# EAGLE design packmonitor (EAGLE 7.3.0)
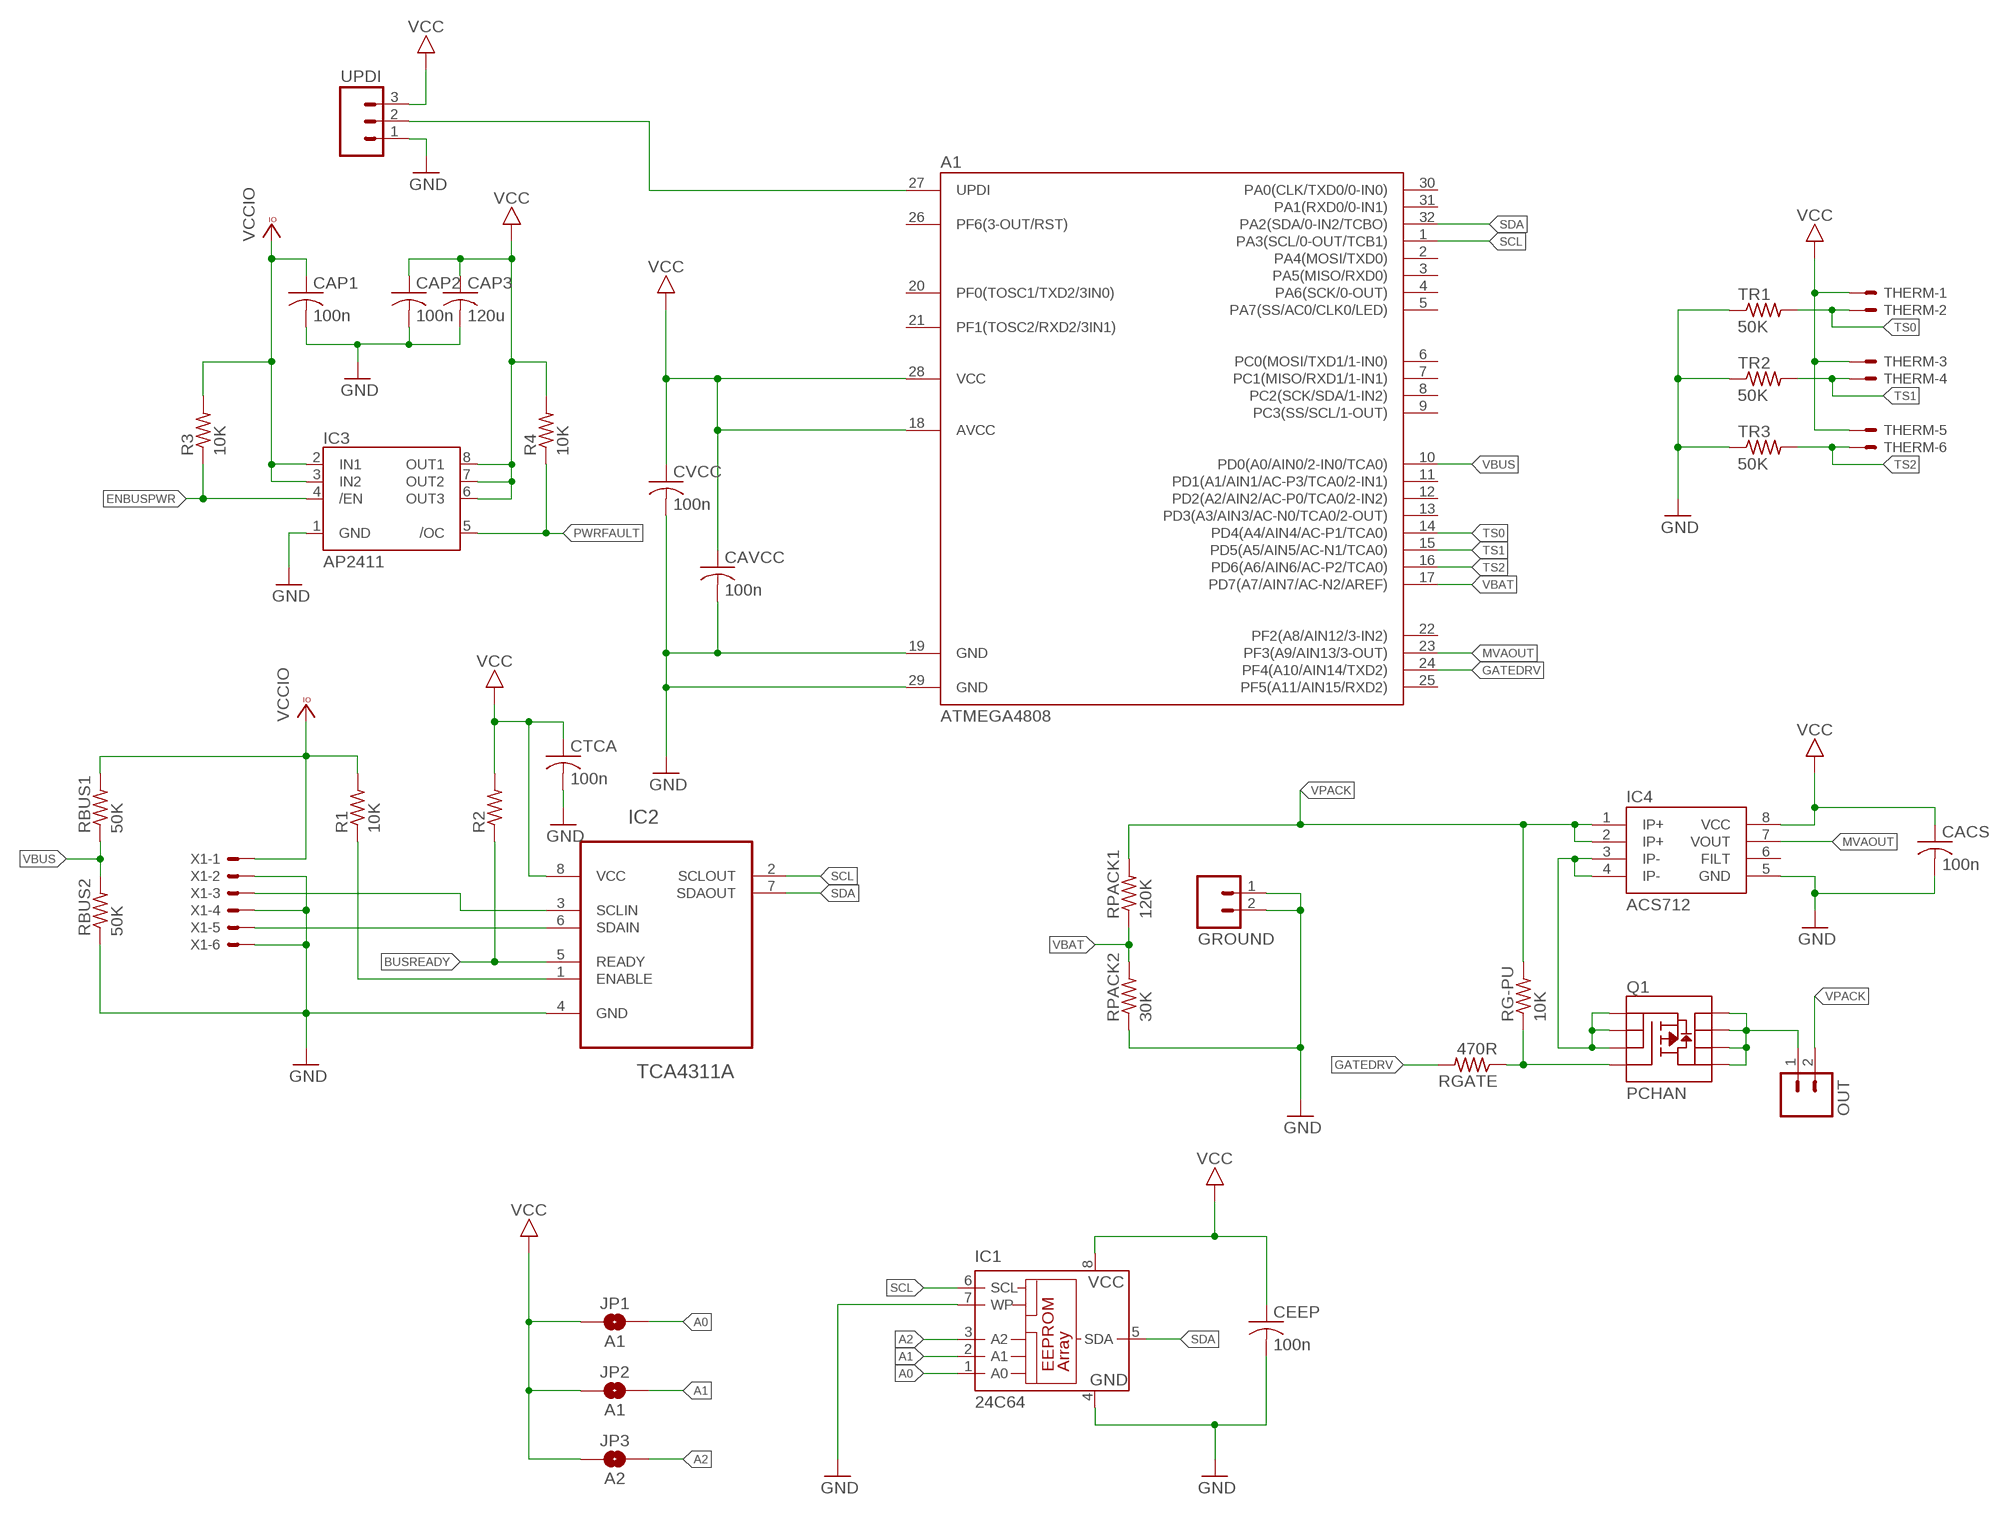
[diagram p0: schematic, sheet 1]

## Parts
A1  ATMEGA4808  ATMEGA4808-TQFN32A  [TQFP32-08]
CACS  100n  C-USC0603  [C0603]
CAP1  100n  C-USC0603  [C0603]
CAP2  100n  C-USC0603  [C0603]
CAP3  120u  C-USC1206  [C1206]
CAVCC  100n  C-USC0603  [C0603]
CEEP  100n  C-USC0603  [C0603]
CTCA  100n  C-USC0603  [C0603]
CVCC  100n  C-USC0603  [C0603]
GROUND  M023.5MM  [SCREWTERMINAL-3.5MM-2]
IC1  24C64  24C04CSN  [SO-08]
IC2  TCA4311A  PCA9511AD,118  [SOIC127P600X175-8N]
IC3  AP2411  TPS2041BD  [SO08]
IC4  ACS712  [SO08]
JP1  A1  JUMPER-SMT_2_NO_SILK  [SMT-JUMPER_2_NO_SILK]
JP2  A1  JUMPER-SMT_2_NO_SILK  [SMT-JUMPER_2_NO_SILK]
JP3  A2  JUMPER-SMT_2_NO_SILK  [SMT-JUMPER_2_NO_SILK]
OUT  M023.5MM  [SCREWTERMINAL-3.5MM-2]
Q1  PCHAN  MOSFET-PCHANNEL-SOIC8SOIC8  [SO08]
R1  10K  R-US_R0603  [R0603]
R2  R-US_R0603  [R0603]
R3  10K  R-US_R0603  [R0603]
R4  10K  R-US_R0603  [R0603]
RBUS1  50K  R-US_R0805  [R0805]
RBUS2  50K  R-US_R0805  [R0805]
RG-PU  10K  R-US_R0603  [R0603]
RGATE  470R  R-US_R0603  [R0603]
RPACK1  120K  R-US_R0805  [R0805]
RPACK2  30K  R-US_R0805  [R0805]
THERM  JST-XH-06-PIN-ROUND-PAD  [JST-XH-06-PACKAGE-ROUND-PAD]
TR1  50K  R-US_R0805  [R0805]
TR2  50K  R-US_R0805  [R0805]
TR3  50K  R-US_R0805  [R0805]
UPDI  M03PTH  [1X03]
X1  JST-XH-06-PIN-LONG-PAD  [JST-XH-06-PACKAGE-LONG-PAD]

## Nets
A0: IC1.1(A0) JP1.2
A1: IC1.2(A1) JP2.2
A2: IC1.3(A2) JP3.2
BUSREADY: IC2.5(READY) R2.1
ENBUSPWR: IC3.4(/EN) R3.1
GATE: Q1.4(G) RG-PU.1 RGATE.1
GATEDRV: A1.24(PF4(A10/AIN14/TXD2)) RGATE.2
GND: A1.19(GND) A1.29(GND) CACS.2 CAP1.2 CAP2.2 CAP3.2 CAVCC.2 CEEP.2 CTCA.2 CVCC.2 GROUND.1 GROUND.2 IC1.4(GND) IC1.7(WP) IC2.4(GND) IC3.1(GND) IC4.5(GND) RBUS2.1 RPACK2.1 TR1.1 TR2.1 TR3.1 UPDI.1 X1.2 X1.4 X1.6
MVAOUT: A1.23(PF3(A9/AIN13/3-OUT)) IC4.7(VOUT)
N$3: IC2.6(SDAIN) X1.5
N$4: IC2.3(SCLIN) X1.3
N$6: IC2.1(ENABLE) R1.1
P+IN: IC4.3(IP-) IC4.4(IP-) Q1.1(S) Q1.2(S) Q1.3(S)
P+OUT: OUT.1 Q1.5(D) Q1.6(D) Q1.7(D) Q1.8(D)
PWRFAULT: IC3.5(/OC) R4.1
SCL: A1.1(PA3(SCL/0-OUT/TCB1)) IC1.6(SCL) IC2.2(SCLOUT)
SDA: A1.32(PA2(SDA/0-IN2/TCBO)) IC1.5(SDA) IC2.7(SDAOUT)
TS0: A1.14(PD4(A4/AIN4/AC-P1/TCA0)) THERM.2 TR1.2
TS1: A1.15(PD5(A5/AIN5/AC-N1/TCA0)) THERM.4 TR2.2
TS2: A1.16(PD6(A6/AIN6/AC-P2/TCA0)) THERM.6 TR3.2
UPDI: A1.27(UPDI) UPDI.2
VBAT: A1.17(PD7(A7/AIN7/AC-N2/AREF)) RPACK1.1 RPACK2.2
VBUS: A1.10(PD0(A0/AIN0/2-IN0/TCA0)) RBUS1.1 RBUS2.2
VCC: A1.18(AVCC) A1.28(VCC) CACS.1 CAP2.1 CAP3.1 CAVCC.1 CEEP.1 CTCA.1 CVCC.1 IC1.8(VCC) IC2.8(VCC) IC3.6(OUT3) IC3.7(OUT2) IC3.8(OUT1) IC4.8(VCC) JP1.1 JP2.1 JP3.1 R2.2 R4.2 THERM.1 THERM.3 THERM.5 UPDI.3
VCCIO: CAP1.1 IC3.2(IN1) IC3.3(IN2) R1.2 R3.2 RBUS1.2 X1.1
VPACK: IC4.1(IP+) IC4.2(IP+) OUT.2 RG-PU.2 RPACK1.2
Unconnected: A1.2(PA4(MOSI/TXD0)) A1.3(PA5(MISO/RXD0)) A1.4(PA6(SCK/0-OUT)) A1.5(PA7(SS/AC0/CLK0/LED)) A1.6(PC0(MOSI/TXD1/1-IN0)) A1.7(PC1(MISO/RXD1/1-IN1)) A1.8(PC2(SCK/SDA/1-IN2)) A1.9(PC3(SS/SCL/1-OUT)) A1.11(PD1(A1/AIN1/AC-P3/TCA0/2-IN1)) A1.12(PD2(A2/AIN2/AC-P0/TCA0/2-IN2)) A1.13(PD3(A3/AIN3/AC-N0/TCA0/2-OUT)) A1.20(PF0(TOSC1/TXD2/3IN0)) A1.21(PF1(TOSC2/RXD2/3IN1)) A1.22(PF2(A8/AIN12/3-IN2)) A1.25(PF5(A11/AIN15/RXD2)) A1.26(PF6(3-OUT/RST)) A1.30(PA0(CLK/TXD0/0-IN0)) A1.31(PA1(RXD0/0-IN1)) IC4.6(FILT)

## Library data of the parts
A1 = microchip-special:ATMEGA4808-TQFN32
CACS CAP1-CAP3 CAVCC CEEP CTCA CVCC = rcl:C-US: CAPACITOR, American symbol
GROUND OUT = SparkFun-Connectors:M02: Standard 2-pin 0.1" header. Use with - straight break away headers ( PRT-00116) - right angle break away headers (PRT-00553) - swiss pins (PRT-00743) - machine pins (PRT-00117) - female headers (PRT-00115) Molex polarized connector foot print use with: PRT-08233 with associated crimp pins and housings. 2.54_SCREWTERM for use with PRT-10571. 3.5mm Screw Terminal footprints for PRT-08084 5mm Screw Terminal footprints for use with PRT-08432; PROD_ID: CONN-08399
IC1 = microchip:24C*: Serial EEPROM 1 K/2 K/4 K; OC_FARNELL: unknown; OC_NEWARK: unknown
IC2 = NXP_By_element14_Batch_1:PCA9511AD,118: Hot swappable I2C-bus and SMBus bus buffer; MPN: PCA9511AD,118; OC_FARNELL: -; OC_NEWARK: 70R6468; PACKAGE: SOIC-8; SUPPLIER: NXP
IC3 = ti-special:TPS2041B: The TPS204xB/TPS205xB power-distribution switches are intended for applications where heavy capacitive loads and short circuits are likely to be encountered. These devices incorporates 70-m? N-channel MOSFET power switches for power-distribution systems that require multiple power switches in a single package. Each switch is controlled by a logic enable input. Gate drive is provided by an internal charge pump designed to control the power-switch rise times and fall times to minimize current surges during switching. The charge pump requires no external components and allows operation from supplies as low as 2.7 V.
IC4 = SparkFun-AnalogIC:ACS712: Hall-effect-based isolated linear current sensor; PROD_ID: IC-08964
JP1-JP3 = SparkFun-Jumpers:JUMPER-SMT_2_NO: Normally open jumper This jumper has two pads in close proximity to each other. Apply solder to close the connection. Round pads are easier to solder for beginners, but are a lot larger. SparkFun Product that uses the round pads: SparkFun EL Sequencer <https://www.sparkfun.com/products/12781>
Q1 = SparkFun-DiscreteSemi:MOSFET-PCHANNEL-SOIC8: Generic 8-pin PMOSFET
R1-R4 RBUS1 RBUS2 RG-PU RGATE RPACK1 RPACK2 TR1-TR3 = rcl:R-US_: RESISTOR, American symbol
THERM X1 = Rembrandt Electronics - JST XH Connectors v1-0:JST-XH-06-PIN: JST XH Connector 2 Pin Wire to board connector. Pitch: 2,54 mm, (0.100") Number of pins: 6 Created by Rembrandt Electronics www.rembrandtelectronics.com
UPDI = SparkFun-Connectors:M03: Header 3 Standard 3-pin 0.1" header. Use with straight break away headers (SKU : PRT-00116), right angle break away headers (PRT-00553), swiss pins (PRT-00743), machine pins (PRT-00117), and female headers (PRT-00115). Molex polarized connector foot print use with SKU : PRT-08232 with associated crimp pins and housings.

## Board
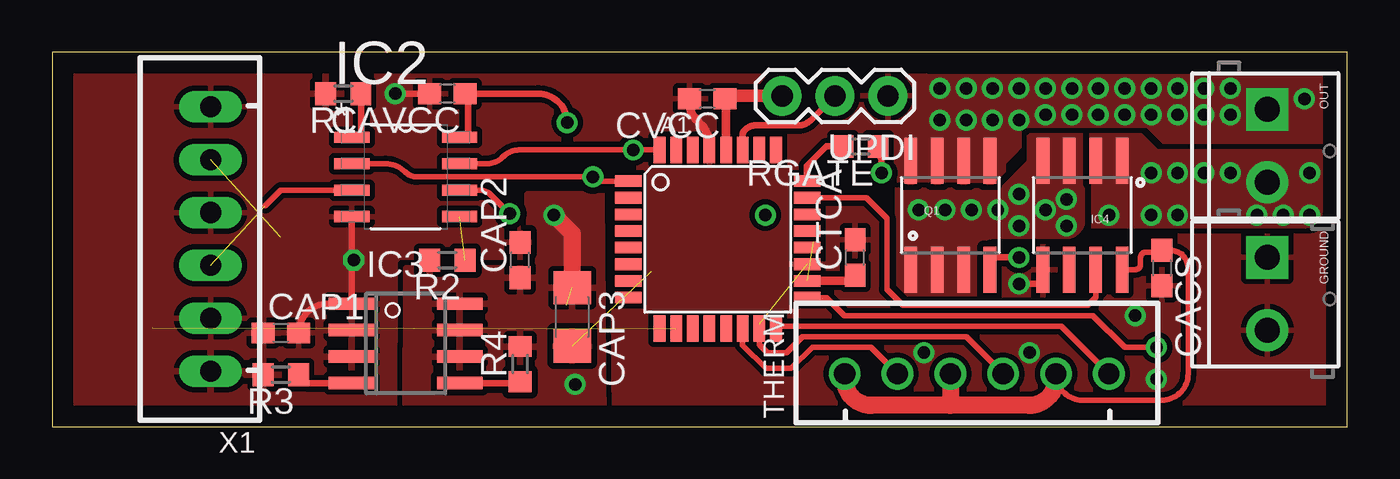
[diagram p1: board, top side]
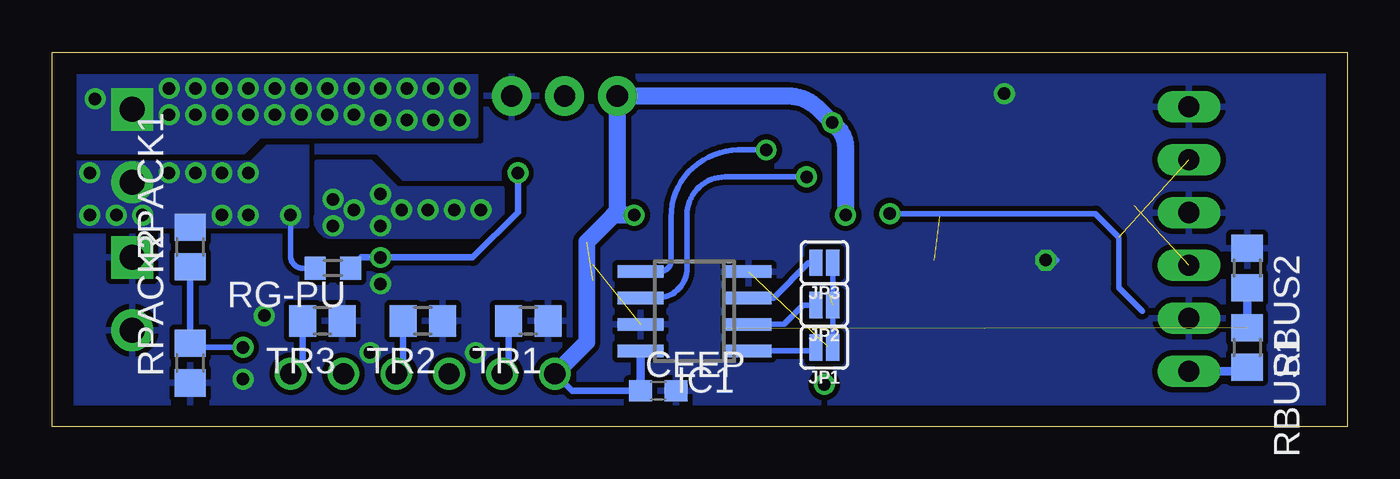
[diagram p2: board, bottom side, seen from below]

Size 62.27 x 18 mm. Coordinates in mm from the lower left corner, seen from the top.
Outline: 0,0 62.27,0 62.27,18 0,18 0,0
Copper layers (1*16): Top 0.035mm / dielectric 1.5mm / Bottom 0.035mm
Design rules "default": minimum track width 10mil, minimum drill 24mil, track to track 8mil, track to pad 8mil, pad to pad 8mil, via to via 8mil, smd to smd 8mil, copper to edge 40mil, drill to drill 8mil, minimum pad ring 10mil, minimum via ring 8mil, stop-mask expansion 4mil, vias tented up to drill 0mil, thermal gap 10mil

### Footprints (pad centres in the part's own frame; a part is rotated, then mirrored left to right if it is on the bottom)
TQFP32-08 = smd 1.27 x 0.559: 1 -4.293,2.8; 2 -4.293,2; 3 -4.293,1.2; 4 -4.293,0.4; 5 -4.293,-0.4; 6 -4.293,-1.2; 7 -4.293,-2; 8 -4.293,-2.8; 17 4.293,-2.8; 18 4.293,-2; 19 4.293,-1.2; 20 4.293,-0.4; 21 4.293,0.4; 22 4.293,1.2; 23 4.293,2; 24 4.293,2.8 | smd 0.559 x 1.27: 9 -2.8,-4.293; 10 -2,-4.293; 11 -1.2,-4.293; 12 -0.4,-4.293; 13 0.4,-4.293; 14 1.2,-4.293; 15 2,-4.293; 16 2.8,-4.293; 25 2.8,4.293; 26 2,4.293; 27 1.2,4.293; 28 0.4,4.293; 29 -0.4,4.293; 30 -1.2,4.293; 31 -2,4.293; 32 -2.8,4.293
C0603 = smd 1.1 x 1: 1 -0.85,0; 2 0.85,0
C1206 = smd 1.6 x 1.8: 1 -1.4,0; 2 1.4,0
SCREWTERMINAL-3.5MM-2 = drill 1.2 pad 2.032 square: 1 0,0 | drill 1.2 pad 2.032: 2 3.5,0
SO-08 = smd 0.6 x 2.2: 1 -1.905,-2.6; 2 -0.635,-2.6; 3 0.635,-2.6; 4 1.905,-2.6; 5 1.905,2.6; 6 0.635,2.6; 7 -0.635,2.6; 8 -1.905,2.6
SOIC127P600X175-8N = smd 1.702 x 0.533: 1 -2.591,1.905; 2 -2.591,0.635; 3 -2.591,-0.635; 4 -2.591,-1.905; 5 2.591,-1.905; 6 2.591,-0.635; 7 2.591,0.635; 8 2.591,1.905
SO08 = smd 0.6 x 2.2: 1 -1.905,-2.6; 2 -0.635,-2.6; 3 0.635,-2.6; 4 1.905,-2.6; 5 1.905,2.6; 6 0.635,2.6; 7 -0.635,2.6; 8 -1.905,2.6
SO08' = smd 0.61 x 2.21: 1 -1.905,-2.616; 2 -0.635,-2.616; 3 0.635,-2.616; 4 1.905,-2.616; 5 1.905,2.616; 6 0.635,2.616; 7 -0.635,2.616; 8 -1.905,2.616
SMT-JUMPER_2_NO_SILK = smd 0.635 x 1.27: 1 -0.406,0; 2 0.406,0
R0603 = smd 1 x 1.1: 1 -0.85,0; 2 0.85,0
R0805 = smd 1.3 x 1.5: 1 -0.95,0; 2 0.95,0
JST-XH-06-PACKAGE-ROUND-PAD = drill 1.016: 1 -6.35,0; 2 -3.81,0; 3 -1.27,0; 4 1.27,0; 5 3.81,0; 6 6.35,0
1X03 = drill 1.016 pad 1.88: 1 0,0; 2 2.54,0; 3 5.08,0
JST-XH-06-PACKAGE-LONG-PAD = drill 1.016 long: 1 -6.35,0; 2 -3.81,0; 3 -1.27,0; 4 1.27,0; 5 3.81,0; 6 6.35,0

### Placement (x,y rotation side)
A1  32,9 0 top
CACS  53.34,7.62 270 top
CAP1  11,4.5 0 top
CAP2  22.5,8 90 top
CAP3  25,5.27 270 top
CAVCC  19,16 180 top
CEEP  33.13,1.72 0 bottom
CTCA  38.61,8.12 90 top
CVCC  31.5,15.75 180 top
GROUND  58.42,8.13 270 top
IC1  31.39,5.55 90 bottom
IC2  17,12 0 top
IC3  17,4 270 top
IC4  ACS712  [SO08']  49.53,10.16 180 top
JP1  25.15,3.81 180 bottom
JP2  25.15,5.84 180 bottom
JP3  25.15,7.87 180 bottom
OUT  58.42,15.24 270 top
Q1  PCHAN  [SO08']  43.18,10.16 0 top
R1  14,16 180 top
R2  19,8 180 top
R3  11,2.5 180 top
R4  22.5,3 90 top
RBUS1  4.83,3.81 270 bottom
RBUS2  4.83,7.62 270 bottom
RG-PU  48.77,7.62 180 bottom
RGATE  38.86,13.46 180 top
RPACK1  55.63,8.64 90 bottom
RPACK2  55.63,3.05 90 bottom
THERM  44.45,2.54 0 top
TR1  39.37,5.08 180 bottom
TR2  44.45,5.08 180 bottom
TR3  49.28,5.08 180 bottom
UPDI  40.18,15.89 180 top
X1  7.62,9.02 90 top

### Tracks (layer width: path | path; a pad name or v marks a point on that pad's centre or on a via)
A0
  Bottom 0.254: IC1.1 25.55,3.64 JP1.2
A1
  Bottom 0.254: JP2.2 26.16,5.84 27.09,4.91 IC1.2
A2
  Bottom 0.254: IC1.3 27.6,6.18 25.91,7.87 JP3.2
BUSREADY  (1 unrouted)
ENBUSPWR
  Top 0.305: R3.1 arc90 12.26,2.1 IC3.4
GATE  (via drill 0.6)
  Top 0.305: 39.88,12.95 v39.88,12.19 | Q1.4 45.09,8.13 v46.48,8.13
  Top 0.406: RGATE.1 39.88,12.95
  Bottom 0.305: v39.88,12.19 39.88,10.3 42.05,8.13 v46.48,8.13 47.41,8.13 RG-PU.1
GATEDRV
  Top 0.305: RGATE.2 37.23,13.46 36.29,12.53 A1.24
GND  (via drill 0.6)  (2 unrouted)
  Top 0.305: CAP1.2 arc-90 13.26,5.91 IC3.1 14.4,8 v14.5,8 14.41,8 IC2.4 | CAVCC.2 v16.5,16 | v46.48,6.86 47.7,6.86 IC4.5
  Top 0.406: CVCC.2 30.65,15.54 arc45 30.97,14.75 31.18,14.54 arc-45 31.6,13.53 A1.29
  Bottom 0.305: v14.5,8 14,8
  other vias: 52.07,5.33 53.09,2.29 41.91,3.56 46.99,3.56
  pour Bottom (isolate 0.254, rank 5): 0,18 62.27,18 62.27,0 0,0
  pour Top (isolate 0.254, rank 5): 62.23,18.03 0,18.03 0,0 62.23,0
MVAOUT
  Top 0.254: A1.23 39.15,11 40.13,10.02 40.13,6.6 40.89,5.84 49.78,5.84 50.16,6.22 IC4.7
N$3  (via drill 0.6)  (1 unrouted)
  Top 0.254: IC2.6 20.56,11.37 arc-45 21.08,11.15 v22,10.23
  Bottom 0.254: 9.86,5.54 11,6.68 11,9.11 12.12,10.23 v22,10.23
N$4  (1 unrouted)
  Top 0.254: 10.26,10.62 11,11.37 IC2.3
N$6
  Top 0.305: R1.1 14.85,13.9 IC2.1
P+IN  (via drill 0.6)
  other vias: 46.48,11.18 46.48,9.65 45.47,10.41 42.93,10.41 41.66,10.41 48.77,9.65 44.2,10.41 47.75,10.41 48.77,10.92
  pour Top (isolate 0.305, rank 3, no thermals): 49.53,13.97 49.53,9.95 arc-90 48.73,9.14 45.25,9.14 arc90 44.45,8.34 44.45,6.35 41.15,6.35 arc-90 40.64,6.86 40.64,11.43 45.72,11.43 46.99,12.7 46.99,13.97
  pour Bottom (isolate 0.254, rank 4, no thermals): 49.53,12.7 49.53,10.22 arc-90 48.96,9.14 40.64,9.14 40.64,11.43 45.72,11.43 46.99,12.7
P+OUT  (via drill 0.6)
  other vias: 42.67,16.26 42.67,14.73 43.94,14.73 43.94,16.26 45.21,16.26 45.21,14.73 46.48,16.26 46.48,14.73 51.56,16.26 51.56,14.99 52.83,14.99 52.83,16.26 54.1,16.26 54.1,14.99 55.37,14.99 55.37,16.26 56.64,16.26 60.2,15.75 56.64,14.99 50.29,16.26 49.02,16.26 47.75,16.26 47.75,14.99 49.02,14.99 50.29,14.99
  pour Top (isolate 0.254, rank 5, no thermals): 45.72,11.43 40.64,11.43 40.64,13.97 41.91,15.24 41.91,17.02 60.96,17.02 60.96,13.21 53.09,13.21 52.32,13.97 46.99,13.97 45.72,12.7
  pour Bottom (isolate 0.254, rank 3, no thermals): 41.91,13.97 41.91,17.02 60.96,17.02 60.96,13.21 53.09,13.21 52.32,13.97
PWRFAULT
  Top 0.305: IC3.5 22.45,2.1 arc90 R4.1
SCL  (via drill 0.6)
  Top 0.254: A1.1 26.2,11.8 v26,12 17.54,12 arc-45 16.97,12.24 16.97,12.24 arc45 16.02,12.63 IC2.2
  Bottom 0.254: IC1.6 33.19,6.18 arc-90 31.75,7.62 31.75,10.16 arc90 29.91,12 v26,12
SDA  (via drill 0.6)
  Top 0.254: IC2.7 20.92,12.63 arc45 21.64,12.94 21.68,12.97 arc-45 22.45,13.29 v27.94,13.29 A1.32
  Bottom 0.254: IC1.5 33.05,7.45 arc-90 32.51,7.99 32.51,10.07 arc90 29.29,13.29 v27.94,13.29
TS0
  Top 0.254: A1.14 33.2,3.91 34.32,2.79 35.53,2.79 36.55,3.81 39.37,3.81 THERM.2
  Bottom 0.305: THERM.2 40.32,2.86 TR1.2
TS1
  Top 0.254: A1.15 34,3.94 34.39,3.56 35.31,3.56 36.07,4.32 43.94,4.32 THERM.4
  Bottom 0.305: THERM.4 45.4,2.86 TR2.2
TS2
  Top 0.254: A1.16 34.8,4.83 48.51,4.83 THERM.6
  Bottom 0.305: THERM.6 50.23,3.11 TR3.2
UPDI
  Top 0.305: A1.27 33.2,14.04 arc-45 33.27,14.22 33.32,14.27 arc-45 33.83,14.48 35.88,14.48 arc45 36.47,14.72 UPDI.2
VBAT  (via drill 0.6)
  Top 0.254: A1.17 37.23,6.2 38.1,5.33 50.04,5.33 51.56,3.81 v53.09,3.81
  Bottom 0.254: v53.09,3.81 55.63,3.81 RPACK2.2
  Bottom 0.305: RPACK1.1 RPACK2.2
VBUS  (1 unrouted)
  Bottom 0.406: RBUS1.1 RBUS2.2
VCC  (via drill 0.6)  (2 unrouted)
  Top 0.254: THERM.5 arc90 49.53,1.27 53.34,1.27 arc90 54.61,2.54 54.61,7.62 arc90 53.76,8.47 CACS.1 53.34,8.38 52.58,8.38 arc90 52.32,8.13 52.32,7.81 arc-90 52.06,7.54 IC4.8
  Top 0.305: CAVCC.1 20,16 | IC2.8 19.59,14 20,14 20,15.85 CAVCC.1 | CAVCC.1 23.37,16 arc-90 v24.77,14.61 | IC4.8 51.44,6.76
  Top 0.406: 32.35,13.29 A1.28 32.4,15.69 CVCC.1 | CTCA.1 38.59,7 A1.18
  Top 0.61: CVCC.1 32.49,15.89 UPDI.3
  Top 0.813: v24.13,10.16 25,9.29 CAP3.1 | THERM.5 48.26,2.31 arc-90 46.97,1.02 43.18,1.02 | 43.18,1.02 39.4,1.02 arc-90 38.1,2.31 THERM.1 | THERM.3 43.18,1.02
  Bottom 0.254: JP1.1 JP2.1 JP3.1
  Bottom 0.305: CEEP.1 37.28,1.72 THERM.1
  Bottom 0.406: CEEP.1 IC1.8
  Bottom 0.813: v24.13,10.16 24.13,13.44 arc-45 24.5,14.34 v24.77,14.61 25.46,15.3 arc-45 26.89,15.89 UPDI.3 35.1,10.2 v34.29,10.16 35.28,10.16 36.58,8.87 36.58,4.06 THERM.1
  other vias: 25.15,2.03
  pour Top (isolate 0.305, rank 4): 17.02,7.62 17,0 26.5,0 26.42,11.18 22.86,11.18 22.86,7.62
VCCIO
  Bottom 0.406: RBUS1.2 5.12,2.67 X1.1
  pour Top (isolate 0.305, rank 5): 6,18 13.95,18 13.97,8.89 17,8.89 17,0 6,0
VPACK  (via drill 0.6)
  Bottom 0.254: RG-PU.2 50.23,7.62 arc90 50.8,8.19 v50.8,10.16
  other vias: 52.83,12.19 52.83,10.16 54.1,12.19 55.37,12.19 56.64,12.19 54.1,10.16 57.91,10.16 60.45,12.19 60.45,10.16 59.18,10.16
  pour Top (isolate 0.305, rank 4, no thermals): 60.96,13.21 60.96,10.46 arc-90 60.16,9.65 50.04,9.65 arc-90 49.53,10.16 49.53,13.97 52.32,13.97 53.09,13.21
  pour Bottom (isolate 0.305, rank 4, no thermals): 60.96,9.65 50.04,9.65 50.04,13.72 52.58,13.72 53.09,13.21 60.96,13.21